# Altium schematic sheet ORD_POWER.SchDoc
size 420 x 297 mm; Address1: Address1; Address2: Address2; Address3: Address3; Address4: Address4; DocumentNumber: АБВГ.123456.001 Э3; SheetNumber: 1; Scale: 1:1; DocumentType: Схема электрическая принципиальная; FirstReferrence: АБВГ.123456.001
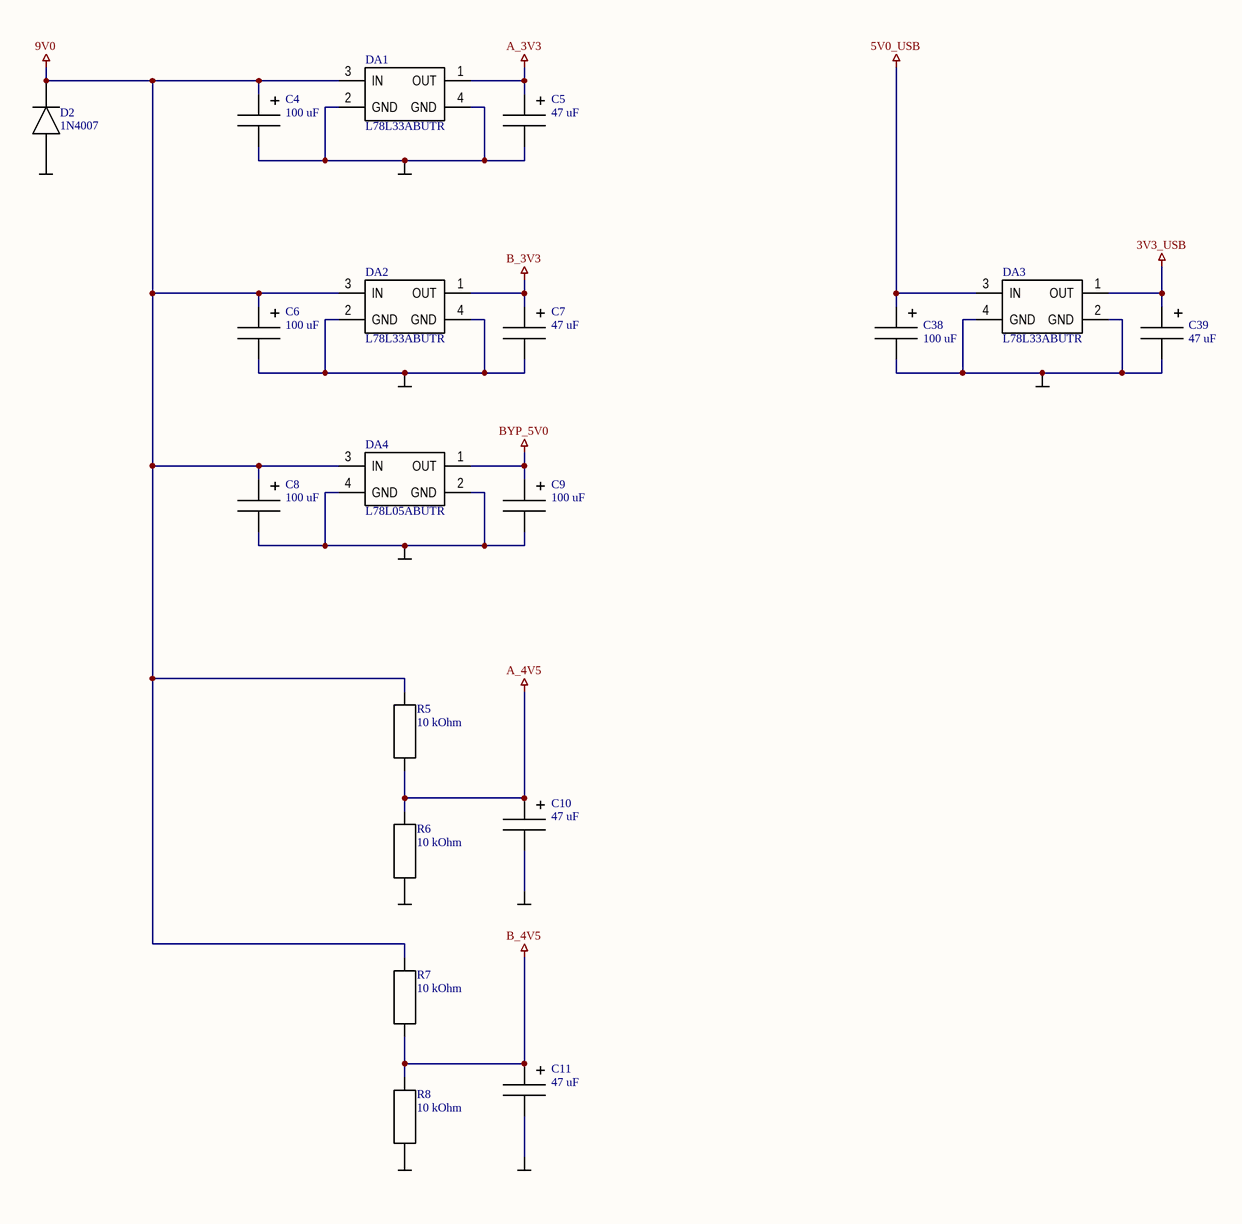
[diagram p0: ORD_POWER.SchDoc]

## Parts
C4  100 uF  [C7343_CASE-D]
C5  47 uF  [C3528_CASE-B]
C6  100 uF  [C7343_CASE-D]
C7  47 uF  [C3528_CASE-B]
C8  100 uF  [C7343_CASE-D]
C9  100 uF  [C3528_CASE-B]
C10  47 uF  [C3528_CASE-B]
C11  47 uF  [C3528_CASE-B]
C38  100 uF  [C7343_CASE-D]
C39  47 uF  [C3528_CASE-B]
D2  1N4007  [DO-41]
DA1  L78L33ABUTR  [SOT-89]
DA2  L78L33ABUTR  [SOT-89]
DA3  L78L33ABUTR  [SOT-89]
DA4  L78L05ABUTR  [SOT-89]
R5  10 kOhm  [R0805[2012]]
R6  10 kOhm  [R0805[2012]]
R7  10 kOhm  [R0805[2012]]
R8  10 kOhm  [R0805[2012]]

## Nets
3V3_USB: C39.1 DA3.1(OUT)
5V0_USB: C38.1 DA3.3(IN)
9V0: C4.1 C6.1 C8.1 D2.1(K) DA1.3(IN) DA2.3(IN) DA4.3(IN) R5.2 R7.2
A_3V3: C5.1 DA1.1(OUT)
A_4V5: C10.1 R5.1 R6.2
B_3V3: C7.1 DA2.1(OUT)
B_4V5: C11.1 R7.1 R8.2
BYP_5V0: C9.1 DA4.1(OUT)
GND: C4.2 C5.2 C6.2 C7.2 C8.2 C9.2 C10.2 C11.2 C38.2 C39.2 D2.2(A) DA1.2(GND) DA1.4(GND) DA2.2(GND) DA2.4(GND) DA3.2(GND) DA3.4(GND) DA4.2(GND) DA4.4(GND) R6.1 R8.1

## Notes on the sheet
- Перв. примен.
- Справ. №
- Подп. и дата
- Инв. № дубл.
- Взам. инв. №
- Разраб.
- Изм.
- Лист
- № докум.
- Подп.
- Дата
- Лит.
- Масса
- Масштаб
- Пров.
- Т.контр.
- Листов
- Инв. № подл.
- Утв.
- Н.контр.
- 2.106-A3
- Копировал
- Формат А3

## Library data of the parts
C4-C11 C38 C39 = Capacitor_Pol: Manufacture: *; ManufacturerPartNumber: *; Power/Voltage: *; Quantity: *; Rem: *; TKE: *; Tolerance: *; Корпус: *; Примечание: *
  C4 C6 C8 C9 C38: Value: 100 uF
  C5 C7 C10 C11 C39: Value: 47 uF
D2 = 1N4007: Geometry.Height: 1.35mm; Manufacturer_Name: 1N4007; Manufacturer_Part_Number: 1N4007
DA1-DA3 = L78L33ABUTR: Standard Regulator Pos 3.3V 0.1A L78L33ABUTR, Single Linear Voltage Regulator, 100mA 3.3 V, 3-Pin SOT-89; Manufacturer_Name: New Japan Radio; Manufacturer_Part_Number: NJM78L05UA-TE1; Allied_Number: R1030699; Mouser Part Number: *; Mouser Price/Stock: *; RS Part Number: 7139502P; RS Price/Stock: http://uk.rs-online.com/web/p/products/7139502P; Allied Price/Stock: https://www.alliedelec.com/new-japan-radio-njm78l05ua-te1/R1030699/; Datasheet Link: http://uk.rs-online.com/web/p/products/7139502
DA4 = L78L05ABUTR: Standard Regulator Pos 5V 0.1A L78L05ABUTR, Single Linear Voltage Regulator, 100mA 5 V, 3-Pin SOT-89; Manufacturer_Name: New Japan Radio; Manufacturer_Part_Number: NJM78L05UA-TE1; Allied_Number: R1030699; Mouser Part Number: *; Mouser Price/Stock: *; RS Part Number: 7139502P; RS Price/Stock: http://uk.rs-online.com/web/p/products/7139502P; Allied Price/Stock: https://www.alliedelec.com/new-japan-radio-njm78l05ua-te1/R1030699/; Datasheet Link: http://uk.rs-online.com/web/p/products/7139502
R5-R8 = Resistor: Manufacture: *; ManufacturerPartNumber: *; Power/Voltage: *; Quantity: *; Rem: *; TKE: *; Tolerance: *; Корпус: *; Примечание: *; Value: 10 kOhm